# EAGLE design plasma (EAGLE 5.10)
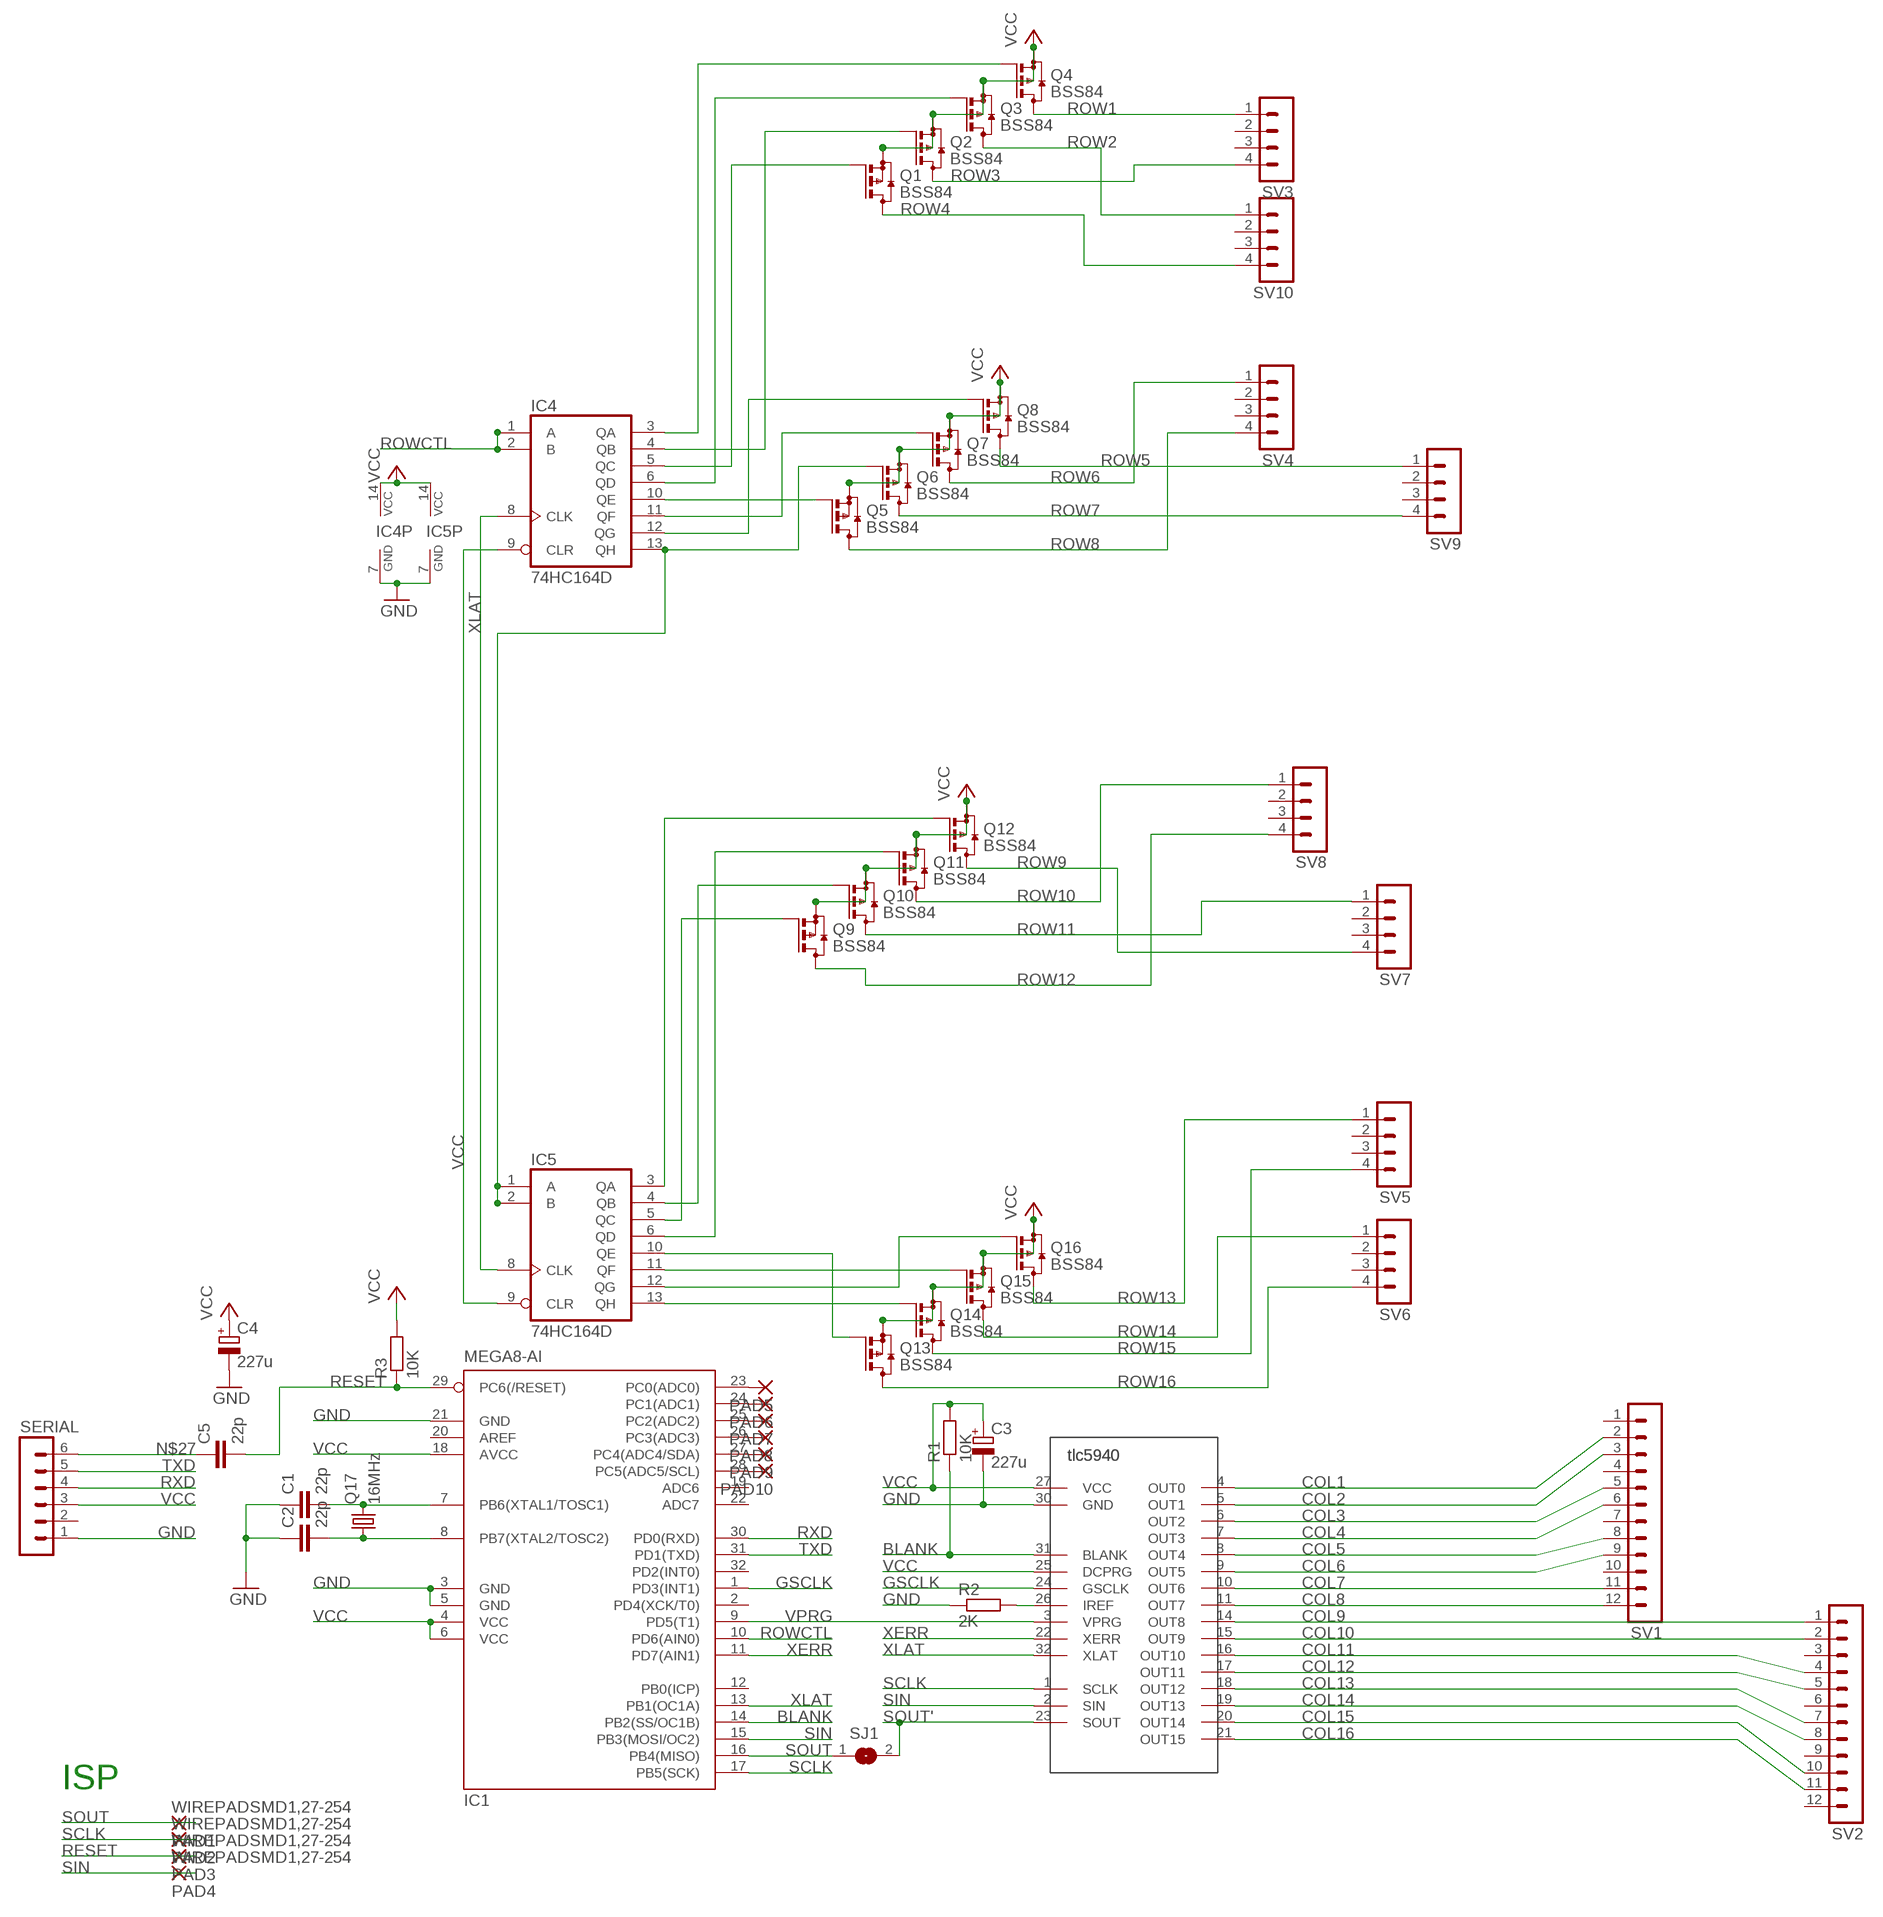
[diagram p0: schematic, sheet 1]

## Parts
C1  22p  C-EUC0603  [C0603]
C2  22p  C-EUC0603  [C0603]
C3  227u  CPOL-EUC/6032-28R  [C/6032-28R]
C4  227u  CPOL-EUC/6032-28R  [C/6032-28R]
C5  22p  C-EUC0603  [C0603]
IC1  MEGA8-AI  [TQFP32-08]
IC2  TLC5940-RHB  [RHB_S-PQFP-N32]
IC4  74HC164D  [SO14]
IC5  74HC164D  [SO14]
PAD1  WIREPADSMD1,27-254  [SMD1,27-2,54]
PAD2  WIREPADSMD1,27-254  [SMD1,27-2,54]
PAD3  WIREPADSMD1,27-254  [SMD1,27-2,54]
PAD4  WIREPADSMD1,27-254  [SMD1,27-2,54]
PAD5  1,6/0,8  [1,6/0,8]
PAD6  1,6/0,8  [1,6/0,8]
PAD7  1,6/0,8  [1,6/0,8]
PAD8  1,6/0,8  [1,6/0,8]
PAD9  1,6/0,8  [1,6/0,8]
PAD10  1,6/0,8  [1,6/0,8]
Q1  BSS84  [SOT23]
Q2  BSS84  [SOT23]
Q3  BSS84  [SOT23]
Q4  BSS84  [SOT23]
Q5  BSS84  [SOT23]
Q6  BSS84  [SOT23]
Q7  BSS84  [SOT23]
Q8  BSS84  [SOT23]
Q9  BSS84  [SOT23]
Q10  BSS84  [SOT23]
Q11  BSS84  [SOT23]
Q12  BSS84  [SOT23]
Q13  BSS84  [SOT23]
Q14  BSS84  [SOT23]
Q15  BSS84  [SOT23]
Q16  BSS84  [SOT23]
Q17  16MHz  CRYSTALHC49UP  [HC49UP]
R1  10K  R-EU_0207/10  [0207/10]
R2  2K  R-EU_0207/10  [0207/10]
R3  10K  R-EU_0207/10  [0207/10]
SERIAL  MA06-1  [MA06-1]
SJ1  SJ  [SJ]
SV1  MA12-1  [MA12-1]
SV2  MA12-1  [MA12-1]
SV3  MA04-1  [MA04-1]
SV4  MA04-1  [MA04-1]
SV5  MA04-1  [MA04-1]
SV6  MA04-1  [MA04-1]
SV7  MA04-1  [MA04-1]
SV8  MA04-1  [MA04-1]
SV9  MA04-1  [MA04-1]
SV10  MA04-1  [MA04-1]

## Nets
BLANK: IC1.14(PB2(SS/OC1B)) IC2.31(BLANK) R1.1
COL1: IC2.4(OUT0) SV1.2
COL2: IC2.5(OUT1) SV1.3
COL3: IC2.6(OUT2) SV1.5
COL4: IC2.7(OUT3) SV1.6
COL5: IC2.8(OUT4) SV1.8
COL6: IC2.9(OUT5) SV1.9
COL7: IC2.10(OUT6) SV1.11
COL8: IC2.11(OUT7) SV1.12
COL9: IC2.14(OUT8) SV2.1
COL10: IC2.15(OUT9) SV2.2
COL11: IC2.16(OUT10) SV2.4
COL12: IC2.17(OUT11) SV2.5
COL13: IC2.18(OUT12) SV2.7
COL14: IC2.19(OUT13) SV2.8
COL15: IC2.20(OUT14) SV2.10
COL16: IC2.21(OUT15) SV2.11
GND: C1.1 C2.1 C3.- C4.- IC1.3(GND) IC1.5(GND) IC1.21(GND) IC2.30(GND) IC4.7(GND) IC5.7(GND) R2.1 SERIAL.1
GSCLK: IC1.1(PD3(INT1)) IC2.24(GSCLK)
N$1: IC2.26(IREF) R2.2
N$2: C1.2 IC1.7(PB6(XTAL1/TOSC1)) Q17.2
N$3: C2.2 IC1.8(PB7(XTAL2/TOSC2)) Q17.1
N$4: IC4.3(QA) Q4.1(G)
N$5: IC1.23(PC0(ADC0)) PAD5.1(P)
N$6: IC1.24(PC1(ADC1)) PAD6.1(P)
N$7: IC4.4(QB) Q2.1(G)
N$8: IC4.5(QC) Q1.1(G)
N$9: IC4.6(QD) Q3.1(G)
N$10: IC4.10(QE) Q5.1(G)
N$11: IC4.11(QF) Q7.1(G)
N$12: IC4.12(QG) Q8.1(G)
N$13: IC5.3(QA) Q12.1(G)
N$14: IC5.4(QB) Q10.1(G)
N$15: IC5.5(QC) Q9.1(G)
N$16: IC5.6(QD) Q11.1(G)
N$17: IC5.10(QE) Q13.1(G)
N$18: IC4.13(QH) IC5.1(A) IC5.2(B) Q6.1(G)
N$19: IC5.11(QF) Q15.1(G)
N$20: IC5.12(QG) Q16.1(G)
N$21: IC5.13(QH) Q14.1(G)
N$22: IC1.25(PC2(ADC2)) PAD7.1(P)
N$24: IC1.26(PC3(ADC3)) PAD8.1(P)
N$25: IC1.27(PC4(ADC4/SDA)) PAD9.1(P)
N$26: IC1.28(PC5(ADC5/SCL)) PAD10.1(P)
N$27: C5.1 SERIAL.6
RESET: C5.2 IC1.29(PC6(/RESET)) PAD3.1(P) R3.1
ROW1: Q4.3(D) SV3.1
ROW2: Q3.3(D) SV10.1
ROW3: Q2.3(D) SV3.4
ROW4: Q1.3(D) SV10.4
ROW5: Q8.3(D) SV9.1
ROW6: Q7.3(D) SV4.1
ROW7: Q6.3(D) SV9.4
ROW8: Q5.3(D) SV4.4
ROW9: Q12.3(D) SV7.4
ROW10: Q11.3(D) SV8.1
ROW11: Q10.3(D) SV7.1
ROW12: Q9.3(D) SV8.4
ROW13: Q16.3(D) SV5.1
ROW14: Q15.3(D) SV6.1
ROW15: Q14.3(D) SV5.4
ROW16: Q13.3(D) SV6.4
ROWCTL: IC1.10(PD6(AIN0)) IC4.1(A) IC4.2(B)
RXD: IC1.30(PD0(RXD)) SERIAL.4
SCLK: IC1.17(PB5(SCK)) IC2.1(SCLK) PAD2.1(P)
SIN: IC1.15(PB3(MOSI/OC2)) IC2.2(SIN) PAD4.1(P)
SOUT: IC1.16(PB4(MISO)) PAD1.1(P) SJ1.1
SOUT': IC2.23(SOUT) SJ1.2
TXD: IC1.31(PD1(TXD)) SERIAL.5
VCC: C3.+ C4.+ IC1.4(VCC) IC1.6(VCC) IC1.18(AVCC) IC2.25(DCPRG) IC2.27(VCC) IC4.9(CLR) IC4.14(VCC) IC5.9(CLR) IC5.14(VCC) Q1.2(S) Q2.2(S) Q3.2(S) Q4.2(S) Q5.2(S) Q6.2(S) Q7.2(S) Q8.2(S) Q9.2(S) Q10.2(S) Q11.2(S) Q12.2(S) Q13.2(S) Q14.2(S) Q15.2(S) Q16.2(S) R1.2 R3.2 SERIAL.3
VPRG: IC1.9(PD5(T1)) IC2.3(VPRG)
XERR: IC1.11(PD7(AIN1)) IC2.22(XERR)
XLAT: IC1.13(PB1(OC1A)) IC2.32(XLAT) IC4.8(CLK) IC5.8(CLK)
Unconnected: IC1.2(PD4(XCK/T0)) IC1.12(PB0(ICP)) IC1.19(ADC6) IC1.20(AREF) IC1.22(ADC7) IC1.32(PD2(INT0)) SERIAL.2 SV1.1 SV1.4 SV1.7 SV1.10 SV2.3 SV2.6 SV2.9 SV2.12 SV3.2 SV3.3 SV4.2 SV4.3 SV5.2 SV5.3 SV6.2 SV6.3 SV7.2 SV7.3 SV8.2 SV8.3 SV9.2 SV9.3 SV10.2 SV10.3

## Notes on the sheet
- ISP

## Library data of the parts
C1 C2 C5 = rcl:C-EU: CAPACITOR, European symbol
C3 C4 = rcl:CPOL-EU: POLARIZED CAPACITOR, European symbol
IC1 = atmel:MEGA8: MICROCONTROLLER 8 Kbytes FLASH, 1 kbytes SRAM, 512 bytes EEPROM, USART, 6-channel 10 bit ADC, 2-channel 8 bit ADC Pin compatible with Atmega48, ATMega88, ATMega168 Source: avr.lbr
IC2 = TLC5490:TLC5940-RHB
IC4 IC5 = 74xx-eu:74*164: 8-bit parallel out SHIFT REGISTER
PAD1-PAD4 = wirepad:WIREPAD: Wire PAD connect wire on PCB
PAD5-PAD10 = wirepad:1,6/0,8: THROUGH-HOLE PAD
Q1-Q16 = transistor-small-signal:BSS84: P-CHANNEL MOS FET
Q17 = crystal:CRYSTAL: CRYSTAL
R1-R3 = rcl:R-EU_: RESISTOR, European symbol
SERIAL = con-lstb:MA06-1: PIN HEADER
SJ1 = jumper:SJ: SMD solder JUMPER
SV1 SV2 = con-lstb:MA12-1: PIN HEADER
SV3-SV10 = con-lstb:MA04-1: PIN HEADER

## Board
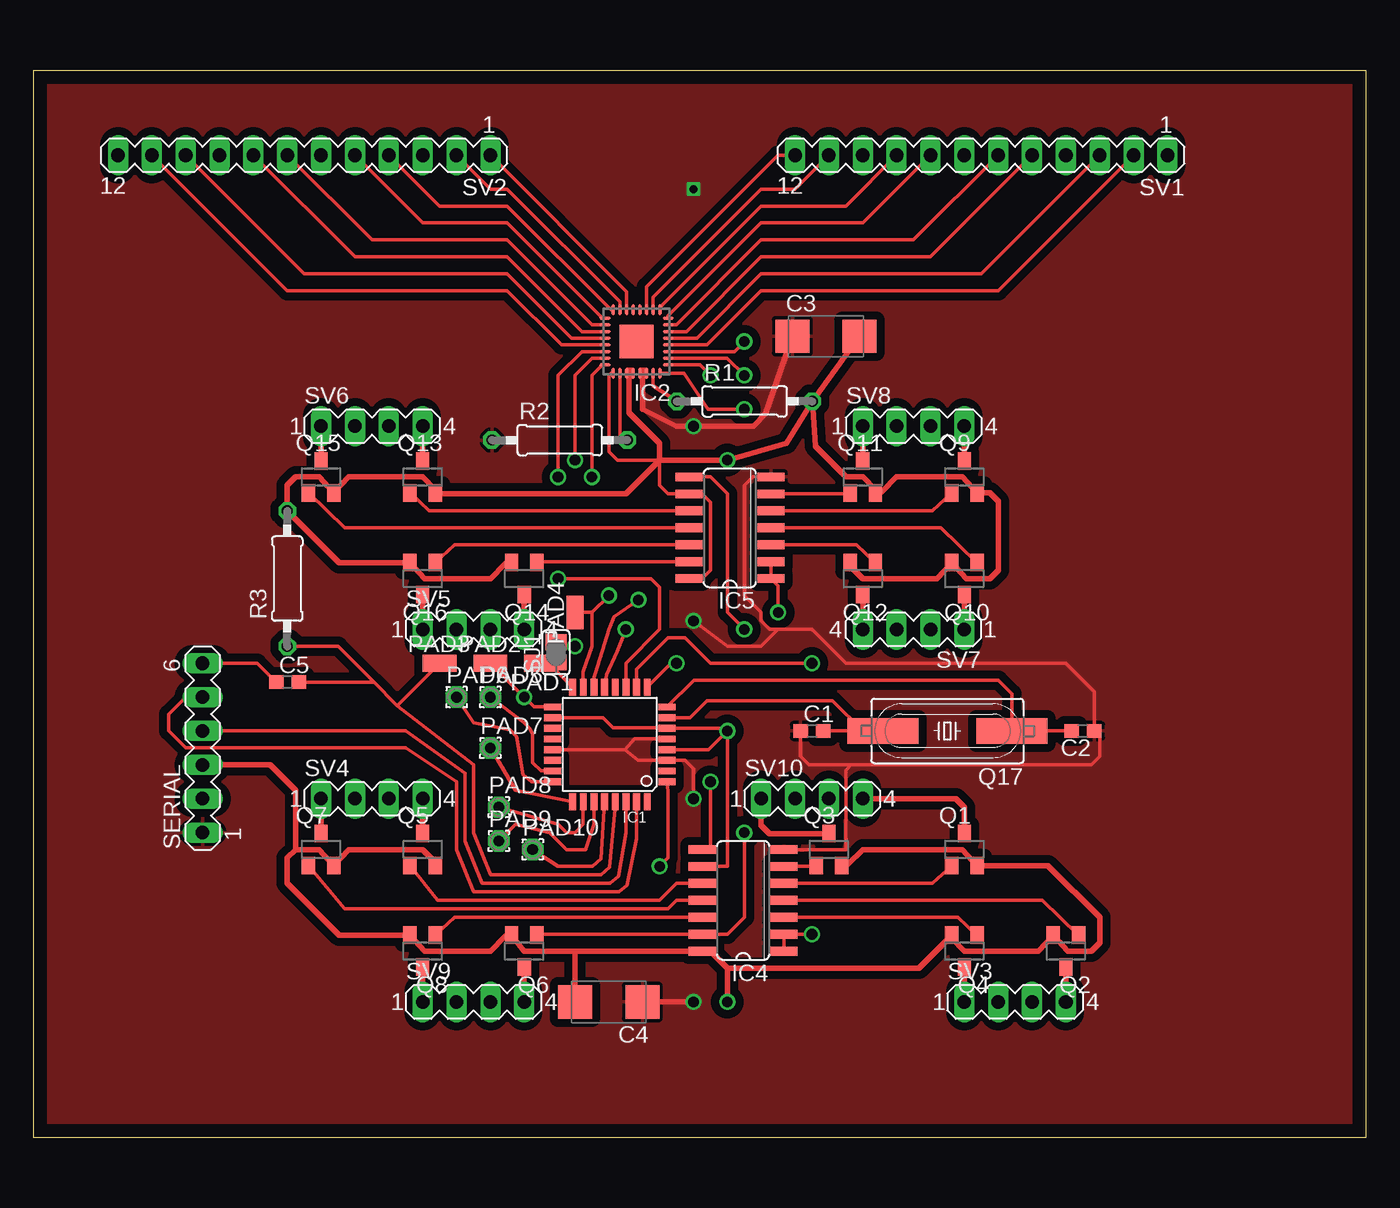
[diagram p1: board, top side]
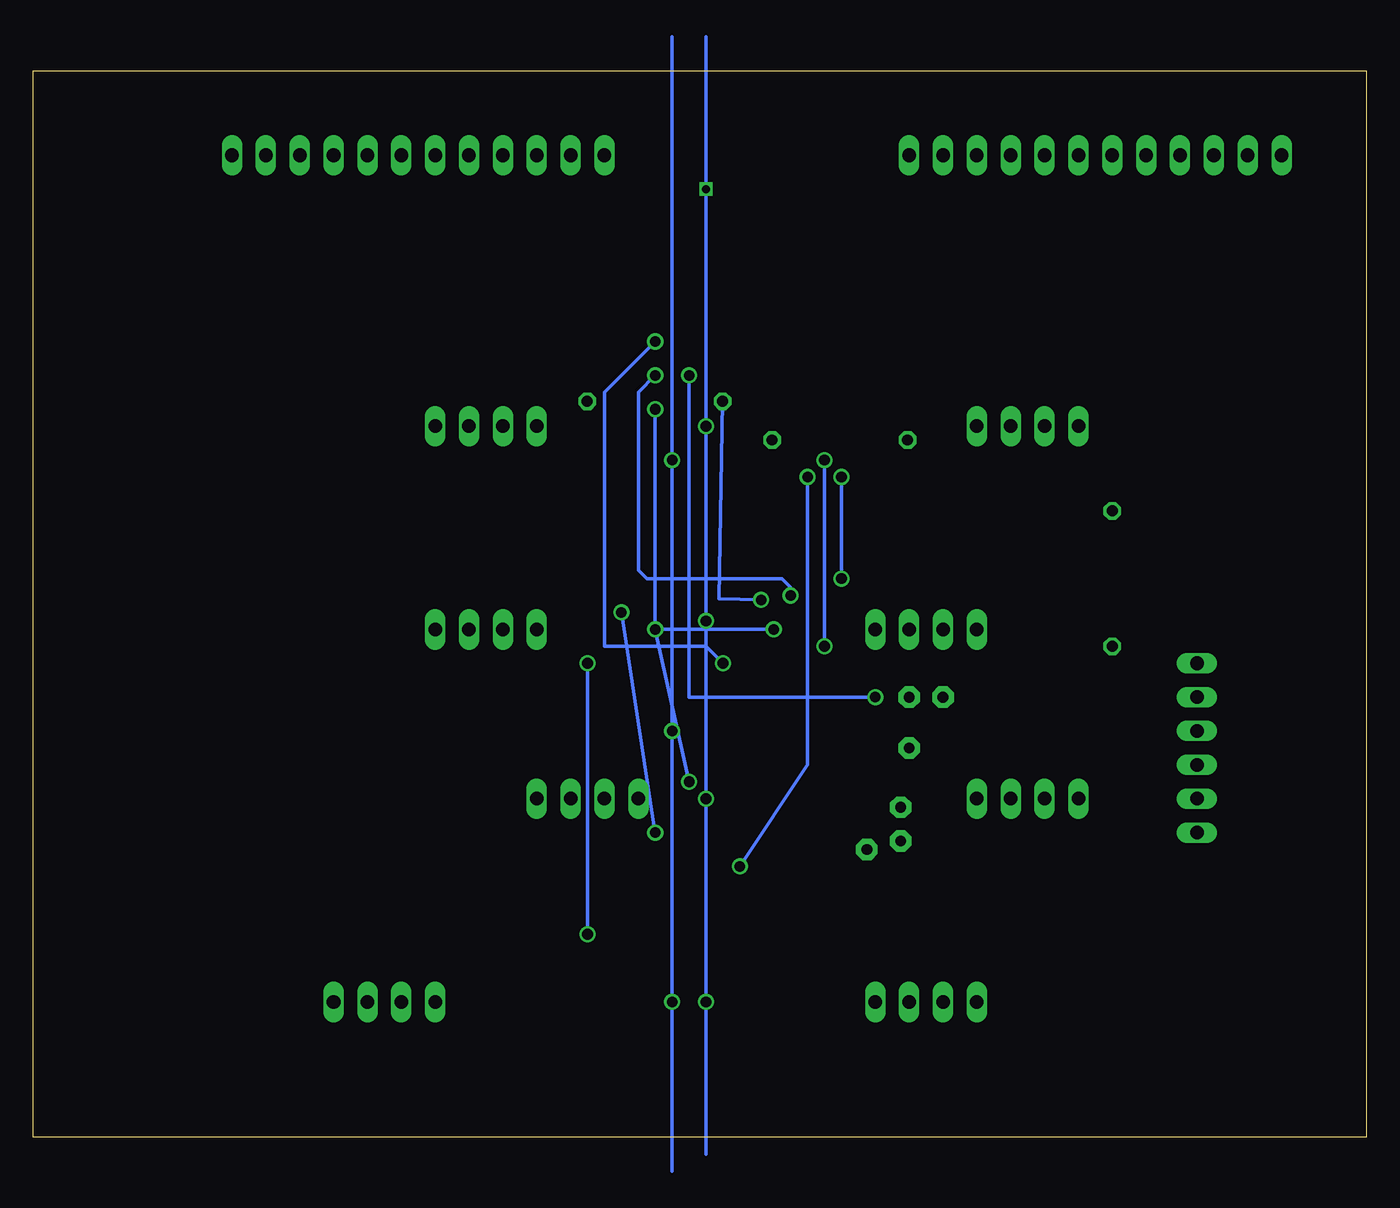
[diagram p2: board, bottom side, seen from below]

Size 100 x 80 mm. Coordinates in mm from the lower left corner, seen from the top.
Outline: 0,0 100,0 100,80 0,80 0,0
Copper layers (1*16): Top 0.035mm / dielectric 1.5mm / Bottom 0.035mm
Design rules "default": minimum track width 10mil, minimum drill 24mil, track to track 8mil, track to pad 8mil, pad to pad 8mil, via to via 8mil, smd to smd 8mil, copper to edge 40mil, drill to drill 8mil, minimum pad ring 10mil, minimum via ring 8mil, stop-mask expansion 4mil, vias tented up to drill 0mil, thermal gap 10mil

### Footprints (pad centres in the part's own frame; a part is rotated, then mirrored left to right if it is on the bottom)
C0603 = smd 1.1 x 1: 1 -0.85,0; 2 0.85,0
C/6032-28R = smd 2.55 x 2.5: + 2.525,0; - -2.525,0
TQFP32-08 = smd 1.27 x 0.508: 1 -4.293,2.8; 2 -4.293,2; 3 -4.293,1.2; 4 -4.293,0.4; 5 -4.293,-0.4; 6 -4.293,-1.2; 7 -4.293,-2; 8 -4.293,-2.8; 17 4.293,-2.8; 18 4.293,-2; 19 4.293,-1.2; 20 4.293,-0.4; 21 4.293,0.4; 22 4.293,1.2; 23 4.293,2; 24 4.293,2.8 | smd 0.508 x 1.27: 9 -2.8,-4.293; 10 -2,-4.293; 11 -1.2,-4.293; 12 -0.4,-4.293; 13 0.4,-4.293; 14 1.2,-4.293; 15 2,-4.293; 16 2.8,-4.293; 25 2.8,4.293; 26 2,4.293; 27 1.2,4.293; 28 0.4,4.293; 29 -0.4,4.293; 30 -1.2,4.293; 31 -2,4.293; 32 -2.8,4.293
RHB_S-PQFP-N32 = smd 0.85 x 0.229: 1 -2.375,1.75; 2 -2.375,1.25; 3 -2.375,0.75; 4 -2.375,0.25; 5 -2.375,-0.25; 6 -2.375,-0.75; 7 -2.375,-1.25; 8 -2.375,-1.75; 17 2.375,-1.75; 18 2.375,-1.25; 19 2.375,-0.75; 20 2.375,-0.25; 21 2.375,0.25; 22 2.375,0.75; 23 2.375,1.25; 24 2.375,1.75 | smd 0.229 x 0.85: 9 -1.75,-2.375; 10 -1.25,-2.375; 11 -0.75,-2.375; 12 -0.25,-2.375; 13 0.25,-2.375; 14 0.75,-2.375; 15 1.25,-2.375; 16 1.75,-2.375; 25 1.75,2.375; 26 1.25,2.375; 27 0.75,2.375; 28 0.25,2.375; 29 -0.25,2.375; 30 -0.75,2.375; 31 -1.25,2.375; 32 -1.75,2.375 | smd 2.54 x 2.54: EXP 0,0
SO14 = smd 0.66 x 2.032: 1 -3.81,-3.073; 2 -2.54,-3.073; 3 -1.27,-3.073; 4 0,-3.073; 5 1.27,-3.073; 6 2.54,-3.073; 7 3.81,-3.073; 8 3.81,3.073; 9 2.54,3.073; 10 1.27,3.073; 11 0,3.073; 12 -1.27,3.073; 13 -2.54,3.073; 14 -3.81,3.073
SMD1,27-2,54 = smd 1.27 x 2.54: 1 0,0
1,6/0,8 = drill 0.813 pad 1.6 octagon: 1 0,0
SOT23 = smd 1 x 1.3: 1 -0.95,-1.2; 2 0.95,-1.2; 3 0,1.2
HC49UP = smd 5.334 x 1.93: 1 -4.826,0; 2 4.826,0
0207/10 = drill 0.813 octagon: 1 -5.08,0; 2 5.08,0
MA06-1 = drill 1.016 long: 1 -6.35,0; 2 -3.81,0; 3 -1.27,0; 4 1.27,0; 5 3.81,0; 6 6.35,0
SJ = smd 1.168 x 1.6: 1 -0.762,0; 2 0.762,0
MA12-1 = drill 1.016 long: 1 -13.97,0; 2 -11.43,0; 3 -8.89,0; 4 -6.35,0; 5 -3.81,0; 6 -1.27,0; 7 1.27,0; 8 3.81,0; 9 6.35,0; 10 8.89,0; 11 11.43,0; 12 13.97,0
MA04-1 = drill 1.016 long: 1 -3.81,0; 2 -1.27,0; 3 1.27,0; 4 3.81,0

### Placement (x,y rotation side)
C1  58.42,30.48 0 top
C2  78.74,30.48 180 top
C3  59.47,60.08 0 top
C4  43.18,10.16 180 top
C5  19.08,34.14 0 top
IC1  43.26,29.48 180 top
IC2  45.26,59.69 180 top
IC4  53.26,17.78 90 top
IC5  52.26,45.72 90 top
PAD1  38.1,35.56 90 top
PAD2  34.29,35.56 270 top
PAD3  30.48,35.56 270 top
PAD4  40.64,39.37 0 top
PAD5  34.29,33.02 0 top
PAD6  31.75,33.02 0 top
PAD7  34.29,29.21 0 top
PAD8  34.92,24.77 0 top
PAD9  34.92,22.23 0 top
PAD10  37.47,21.59 0 top
Q1  69.85,21.59 0 top
Q2  77.47,13.97 180 top
Q3  59.69,21.59 0 top
Q4  69.85,13.97 180 top
Q5  29.21,21.59 0 top
Q6  36.83,13.97 180 top
Q7  21.59,21.59 0 top
Q8  29.21,13.97 180 top
Q9  69.85,49.53 0 top
Q10  69.85,41.91 180 top
Q11  62.23,49.53 0 top
Q12  62.23,41.91 180 top
Q13  29.21,49.53 0 top
Q14  36.83,41.91 180 top
Q15  21.59,49.53 0 top
Q16  29.21,41.91 180 top
Q17  68.58,30.48 180 top
R1  53.37,55.21 0 top
R2  39.49,52.3 0 top
R3  19.05,41.91 90 top
SERIAL  12.7,29.21 90 top
SJ1  39.21,36.37 90 top
SV1  71.12,73.66 180 top
SV2  20.32,73.66 180 top
SV3  73.66,10.16 0 top
SV4  25.4,25.4 0 top
SV5  33.02,38.1 0 top
SV6  25.4,53.34 0 top
SV7  66.04,38.1 180 top
SV8  66.04,53.34 0 top
SV9  33.02,10.16 0 top
SV10  58.42,25.4 0 top

### Tracks (layer width: path | path; a pad name or v marks a point on that pad's centre or on a via)
BLANK  (via drill 0.8)
  Top 0.254: IC2.31 46.51,56.36 v48.29,55.23 48.27,55.23 R1.1 | v45.4,40.31 43.55,39.05 43.18,38.1 41.99,34.25 IC1.14
  Bottom 0.254: v48.29,55.23 48.56,40.41 v45.4,40.31
COL1
  Top 0.254: IC2.4 50.55,59.44 54.61,63.5 72.39,63.5 SV1.2
COL2
  Top 0.254: IC2.5 49.78,59.94 54.61,64.77 71.12,64.77 SV1.3
COL3
  Top 0.254: IC2.6 49.01,60.44 54.61,66.04 67.31,66.04 SV1.5
COL4
  Top 0.254: IC2.7 48.24,60.94 54.61,67.31 66.04,67.31 SV1.6
COL5
  Top 0.254: IC2.8 47.63,61.6 54.61,68.58 62.23,68.58 SV1.8
COL6
  Top 0.254: IC2.9 47.01,62.25 54.61,69.85 60.96,69.85 SV1.9
COL7
  Top 0.254: IC2.10 46.51,63.02 54.61,71.12 57.15,71.12 SV1.11
COL8
  Top 0.254: IC2.11 46.01,63.79 55.88,73.66 SV1.12
COL9
  Top 0.254: IC2.14 44.51,63.44 SV2.1
COL10
  Top 0.254: IC2.15 44.01,62.67 35.56,71.12 34.29,71.12 SV2.2
COL11
  Top 0.254: IC2.16 43.34,62.06 35.56,69.85 30.48,69.85 SV2.4
COL12
  Top 0.254: IC2.17 42.7,61.44 35.56,68.58 29.21,68.58 SV2.5
COL13
  Top 0.254: IC2.18 41.93,60.94 35.56,67.31 25.4,67.31 SV2.7
COL14
  Top 0.254: IC2.19 41.16,60.44 35.56,66.04 24.13,66.04 SV2.8
COL15
  Top 0.254: IC2.20 40.39,59.94 35.56,64.77 20.32,64.77 SV2.10
COL16
  Top 0.254: IC2.21 39.62,59.44 35.56,63.5 19.05,63.5 SV2.11
GND  (via drill 0.6, 0.8)
  Top 0: IC2.30 45.84,57.15 45.72,57.15
  Top 0.254: 44.41,29.08 39.05,29.08 | 44.41,29.08 45.12,29.88 IC1.5 | 44.41,29.08 45.38,28.28 IC1.3 48.9,28.28 49.53,27.64 v49.53,25.4 | C1.1 57.55,30.09 57.55,28.57 58.18,27.94 61.35,27.94 | 61.35,27.94 62.23,27.94 79.38,27.94 80.01,28.57 80.01,30.48 C2.1 79.59,33.44 77.47,35.56 60.96,35.56 58.42,38.1 55.88,38.1 | IC5.7 53.98,49.53 53.34,48.9 53.34,40.64 54.61,39.37 54.61,38.73 55.24,38.1 55.88,38.1 | v49.53,38.73 52.07,36.83 54.61,36.83 55.88,38.1 | 61.35,27.94 60.96,27.55 60.96,21.59 IC4.7
  Top 0.3: 39.05,29.08 IC1.21
  Top 0.406: 45.81,57.31 45.72,57.4 45.72,57.15 45.72,54.61 48.26,53.34 v49.53,53.34 54.02,53.34 54.95,54.27 C3.- | v49.53,10.16 C4.-
  Bottom 0.254: 49.53,-1.27 v49.53,10.16 v49.53,25.4 v49.53,38.73 v49.53,53.34 v49.53,71.12 49.53,82.55
  pour Top (isolate 0.61): 0,80.01 0,0 100.33,0 100.33,80.01
GSCLK  (via drill 0.8)
  Top 0.254: IC2.24 42.7,57.94 41.91,57.15 v41.91,49.53 | IC1.1 47.62,25.97 47.62,20.95 v46.99,20.32
  Bottom 0.254: v46.99,20.32 41.91,27.94 v41.91,49.53
N$1
  Top 0.254: IC2.26 44.01,52.59 R2.2
N$2
  Top 0.254: 62.23,30.48 C1.2 | 62.23,30.48 Q17.2 | IC1.7 49.26,31.48 50.53,32.75 59.96,32.75 62.23,30.48
N$3
  Top 0.254: C2.2 Q17.1 73.41,33.27 72.39,34.29 49.56,34.29 IC1.8
N$4
  Top 0.254: IC4.3 69.36,16.51 Q4.1
N$5
  Top 0.254: PAD5.1 36.83,31.11 37.28,30.67 37.47,30.22 37.47,28.11 38.1,27.48 IC1.23
N$6
  Top 0.254: IC1.24 37.37,26.67 36.74,27.2 36.27,30.05 35.77,30.57 33.02,31.11 PAD6.1
N$7
  Top 0.254: IC4.4 75.71,17.78 Q2.1
N$8
  Top 0.254: IC4.5 67.46,19.05 Q1.1
N$9
  Top 0.254: IC4.6 58.57,20.32
  Top 0.3: 58.57,20.32 Q3.1
N$10
  Top 0.254: IC4.10 48.26,19.05 46.99,17.78 30.34,17.78 Q5.1
N$11
  Top 0.254: IC4.11 48.26,17.78 47.62,17.14 23.35,17.14 Q7.1
N$12
  Top 0.254: IC4.12 31.6,16.51 Q8.1
N$13
  Top 0.254: IC5.3 61.74,44.45 Q12.1
N$14
  Top 0.254: IC5.4 68.09,45.72 Q10.1
N$15
  Top 0.254: IC5.5 67.46,46.99 Q9.1
N$16
  Top 0.254: IC5.6 61.11,48.26
  Top 0.3: 61.11,48.26 Q11.1
N$17
  Top 0.254: IC5.10 29.7,46.99 Q13.1
N$18  (via drill 0.8)
  Top 0.254: 37.95,15.24 IC4.13 52.07,15.24 53.34,16.51 v53.34,22.86 | IC5.2 IC5.1 55.88,41.36 v55.88,39.37
  Top 0.3: Q6.1 37.95,15.24
  Bottom 0.254: v53.34,22.86 v55.88,39.37
N$19
  Top 0.254: IC5.11 23.35,45.72 Q15.1
N$20
  Top 0.254: IC5.12 31.6,44.45 Q16.1
N$21
  Top 0.254: 37.95,43.18 IC5.13
  Top 0.3: Q14.1 37.95,43.18
N$22
  Top 0.254: IC1.25 36.2,26.04 PAD7.1
N$23  (via drill 0.8)
  other vias: 53.34,59.69
N$24
  Top 0.254: PAD8.1 39.37,23.5 40.01,22.86 40.64,22.86 41.26,23.48 IC1.26
N$25
  Top 0.254: PAD9.1 36.2,23.5 38.73,22.86 40.01,21.59 41.42,21.59 42.06,23.5 IC1.27
N$26
  Top 0.254: IC1.28 42.58,20.91 41.95,20.32 39.37,20.32 PAD10.1
N$27
  Top 0.254: SERIAL.6 16.81,35.56 C5.1
RESET
  Top 0.254: IC1.29 43.66,24.61 43.24,20.26 42.6,19.68 34.29,19.68 33.02,22.86 33.02,27.94 27.3,32.38 | 25.52,34.17 27.3,32.38 | 25.52,34.17 22.86,36.83 R3.1 | 27.3,32.38 PAD3.1 | C5.2 25.5,34.14 25.52,34.17
ROW1
  Top 0.406: SV3.1 Q4.3
ROW2
  Top 0.406: Q3.3 55.24,22.79 54.61,23.43 SV10.1
ROW3
  Top 0.406: SV3.4 Q2.3
ROW4
  Top 0.406: Q1.3 69.85,24.13 69.85,24.77 69.22,25.4 SV10.4
ROW5
  Top 0.406: SV9.1 Q8.3
ROW6
  Top 0.406: Q7.3 SV4.1
ROW7
  Top 0.406: SV9.4 Q6.3
ROW8
  Top 0.406: Q5.3 SV4.4
ROW9
  Top 0.406: SV7.4 Q12.3
ROW10
  Top 0.406: Q11.3 SV8.1
ROW11
  Top 0.406: SV7.1 Q10.3
ROW12
  Top 0.406: Q9.3 SV8.4
ROW13
  Top 0.406: SV5.1 Q16.3
ROW14
  Top 0.406: Q15.3 SV6.1
ROW15
  Top 0.406: SV5.4 Q14.3
ROW16
  Top 0.406: Q13.3 SV6.4
ROWCTL  (via drill 0.8)
  Top 0.254: IC4.1 IC4.2 v58.42,15.24 | IC1.10 45.26,35.1 47.62,37.47 48.9,37.47 50.8,35.56 v58.42,35.56
  Bottom 0.254: v58.42,15.24 v58.42,35.56
RXD
  Top 0.254: SERIAL.4 27.94,30.48 32.38,27.3 32.38,22.23 33.66,19.05 43.28,19.05 43.9,19.58 44.45,22.86 IC1.30
SCLK  (via drill 0.8)
  Top 0.254: IC2.1 50.01,57.94 v50.8,57.15 | IC1.17 37.57,32.28 v36.83,33.02 PAD2.1
  Bottom 0.254: v36.83,33.02 50.8,33.02 v50.8,57.15
SIN  (via drill 0.8)
  Top 0.254: IC2.2 52.05,58.44 v53.34,57.15 | IC1.15 41.26,34.91 41.91,36.83 41.91,39.37 | 41.91,39.37 v43.18,40.64 | 41.91,39.37 PAD4.1
  Bottom 0.254: v43.18,40.64 43.18,41.27 43.81,41.91 53.98,41.91 54.61,42.55 54.61,55.88 v53.34,57.15
SOUT
  Top 0.254: IC1.16 38.7,35.54 | PAD1.1 38.67,35.56 38.7,35.54 | 38.7,35.54 SJ1.1
SOUT'  (via drill 0.8)
  Top 0.254: SJ1.2 39.55,36.83 v40.64,36.83 | v40.64,50.8 40.64,57.15 41.93,58.44 IC2.23
  Bottom 0.254: v40.64,36.83 v40.64,50.8
TXD
  Top 0.254: IC1.31 45.26,22.4 44.55,18.92 43.93,18.41 33.02,18.41 31.75,21.59 31.75,26.67 27.94,29.21 11.43,29.21 10.16,30.48 10.16,31.75 11.43,33.02 SERIAL.5
VCC  (via drill 0.8)
  Top 0: IC2.27 44.67,57.15 44.7,57.15
  Top 0.254: 47.5,30.73 43.5,30.73 42.75,31.48 IC1.18 | IC2.25 43.34,57.31 43.18,57.15 43.18,51.44 43.81,50.8 46.99,50.8 46.99,48.9 47.62,48.26 IC5.9 50.16,48.26 50.8,47.62 50.8,42.55 50.16,41.91 IC5.14 | 63.18,48.58 Q11.2 | IC4.9 52.07,20.32 v52.07,30.48 | v52.07,30.48 51.87,30.68 IC1.6 | IC1.4 50.67,29.08 v52.07,30.48
  Top 0.3: 35.39,43.01 Q14.2 | Q13.2 30.16,48.58 | IC1.6 47.5,30.73 | Q11.2 63.67,48.43 | 61.28,42.86 Q12.2
  Top 0.406: 35.39,43.01 34.29,41.91 29.36,41.91 Q16.2 22.93,43.11 R3.2 19.05,48.9 19.68,49.53 21.44,49.53 Q15.2 23.64,49.53 29.21,49.53 30.16,48.58 | Q3.2 61.13,20.49 62.23,21.59 69.7,21.59 Q1.2 76.13,20.39 80.01,16.51 80.01,14.61 79.38,13.97 77.62,13.97 Q2.2 75.42,13.97 69.85,13.97 68.9,14.92 Q4.2 66.43,12.7 52.07,12.7 | Q5.2 30.16,20.64 29.21,21.59 23.64,21.59 Q7.2 21.44,21.59 19.68,21.59 | 19.68,21.59 19.05,20.95 19.05,19.05 22.93,15.17 Q8.2 29.36,13.97 34.29,13.97 35.39,15.07 Q6.2 36.83,13.97 40.64,13.97 | 52.07,12.7 50.82,13.95 IC4.14 40.64,13.97 | 63.67,48.43 64.77,49.53 69.7,49.53 Q9.2 71.75,48.33 72.39,47.7 72.39,42.55 71.75,41.91 70,41.91 Q10.2 67.8,41.91 62.23,41.91 61.28,42.86 | 44.62,57.31 44.7,57.4 44.7,57.15 44.7,54.36 46.99,52.07 46.99,50.8 | 63.18,48.58 62.23,49.53 60.96,49.53 58.67,51.82 R1.2 | 52.07,12.7 v52.07,10.16 | Q13.2 30.23,48.26 44.45,48.26 46.99,50.8 | 46.99,50.8 v52.07,50.8 56.52,52.07 R1.2 | 19.68,21.59 19.68,26.04 17.78,27.94 SERIAL.3 | R1.2 C3.+ | C4.+ 40.66,13.96 40.64,13.97
  Bottom 0.254: 52.07,-2.54 v52.07,10.16 v52.07,30.48 v52.07,50.8 52.07,82.55
VPRG  (via drill 0.8)
  Top 0.254: IC2.3 52.59,58.94 v53.34,59.69 | v48.26,35.56 47.85,35.56 IC1.9
  Bottom 0.254: v53.34,59.69 57.15,55.88 57.15,36.83 49.53,36.83 v48.26,35.56
XERR  (via drill 0.8)
  Top 0.254: IC2.22 41.16,58.94 39.37,57.15 v39.37,49.53 | 44.45,33.78 IC1.11 44.46,35.56 46.99,38.1 46.99,41.27 46.35,41.91 v39.37,41.91
  Bottom 0.254: v39.37,41.91 v39.37,49.53
XLAT  (via drill 0.8)
  Top 0.254: IC2.32 48.84,57.32 50.63,54.61 v53.34,54.61 | IC5.8 50.8,49.53 52.07,48.26 52.07,39.37 v53.34,38.1 | IC4.8 50.8,21.59 v50.8,26.67 | IC1.13 43,34.69 43.79,36.4 v44.45,38.1
  Bottom 0.254: v53.34,38.1 v44.45,38.1 | v50.8,26.67 v53.34,38.1 | v53.34,38.1 v53.34,54.61
(copper drawn outside any net)
  shapes: Top area x2

### Text on the board
Document: VCC | GND